# Altium schematic sheet FMC.SchDoc: FMC
size A4; Engineer: Samer Kilani; DocumentNumber: 5; SheetNumber: 5; SheetTotal: 9
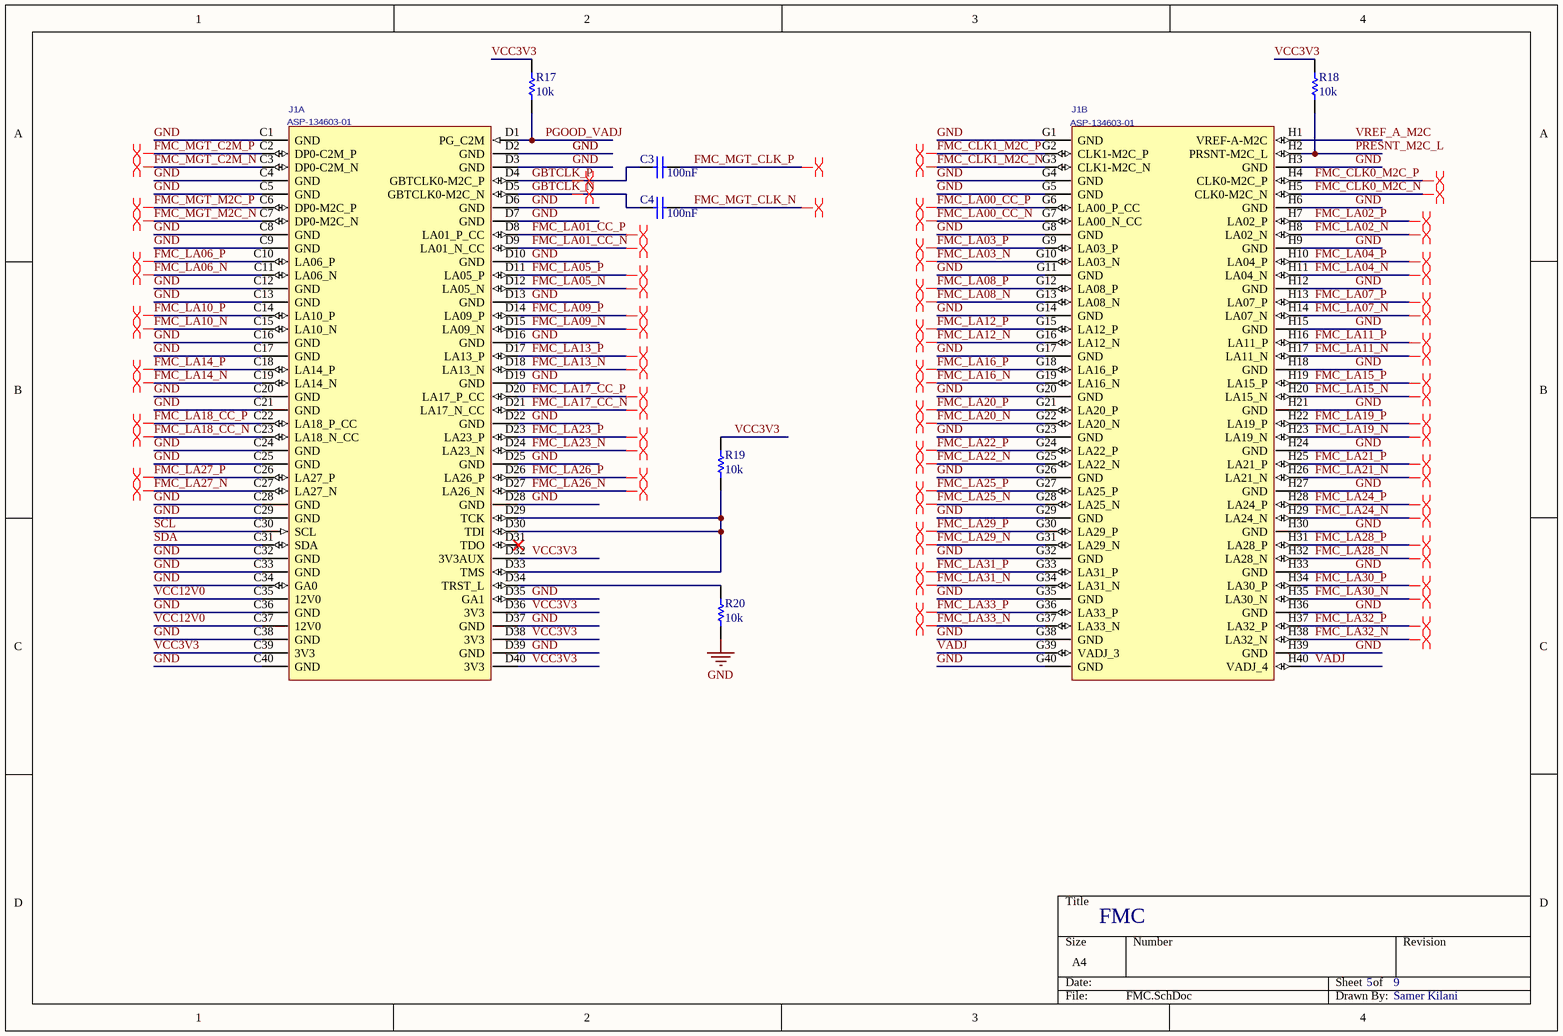
[diagram p0: FMC.SchDoc]

## Parts
C3  value 100nF  [C0402]  (hidden comment: Cap)
C4  value 100nF  [C0402]  (hidden comment: Cap)
J1  ASP-134603-01  [ASP-134603-01]  (parts A,B of 2)
R17  value 10k  [R0402]  (hidden comment: Res)
R18  value 10k  [R0402]  (hidden comment: Res)
R19  value 10k  [R0402]  (hidden comment: Res)
R20  value 10k  [R0402]  (hidden comment: Res)

## Nets
GND: J1.C1(GND) J1.C4(GND) J1.C5(GND) J1.C8(GND) J1.C9(GND) J1.C12(GND) J1.C13(GND) J1.C16(GND) J1.C17(GND) J1.C20(GND) J1.C21(GND) J1.C24(GND) J1.C25(GND) J1.C28(GND) J1.C29(GND) J1.C32(GND) J1.C33(GND) J1.C34(GA0) J1.C36(GND) J1.C38(GND) J1.C40(GND) J1.D2(GND) J1.D3(GND) J1.D6(GND) J1.D7(GND) J1.D10(GND) J1.D13(GND) J1.D16(GND) J1.D19(GND) J1.D22(GND) J1.D25(GND) J1.D28(GND) J1.D35(GA1) J1.D37(GND) J1.D39(GND) J1.G1(GND) J1.G4(GND) J1.G5(GND) J1.G8(GND) J1.G11(GND) J1.G14(GND) J1.G17(GND) J1.G20(GND) J1.G23(GND) J1.G26(GND) J1.G29(GND) J1.G32(GND) J1.G35(GND) J1.G38(GND) J1.G40(GND) J1.H3(GND) J1.H6(GND) J1.H9(GND) J1.H12(GND) J1.H15(GND) J1.H18(GND) J1.H21(GND) J1.H24(GND) J1.H27(GND) J1.H30(GND) J1.H33(GND) J1.H36(GND) J1.H39(GND) R20.1
FMC_CLK0_M2C_N: J1.H5(CLK0-M2C_N)
FMC_CLK0_M2C_P: J1.H4(CLK0-M2C_P)
FMC_CLK1_M2C_N: J1.G3(CLK1-M2C_N)
FMC_CLK1_M2C_P: J1.G2(CLK1-M2C_P)
FMC_LA00_CC_N: J1.G7(LA00_N_CC)
FMC_LA00_CC_P: J1.G6(LA00_P_CC)
FMC_LA01_CC_N: J1.D9(LA01_N_CC)
FMC_LA01_CC_P: J1.D8(LA01_P_CC)
FMC_LA02_N: J1.H8(LA02_N)
FMC_LA02_P: J1.H7(LA02_P)
FMC_LA03_N: J1.G10(LA03_N)
FMC_LA03_P: J1.G9(LA03_P)
FMC_LA04_N: J1.H11(LA04_N)
FMC_LA04_P: J1.H10(LA04_P)
FMC_LA05_N: J1.D12(LA05_N)
FMC_LA05_P: J1.D11(LA05_P)
FMC_LA06_N: J1.C11(LA06_N)
FMC_LA06_P: J1.C10(LA06_P)
FMC_LA07_N: J1.H14(LA07_N)
FMC_LA07_P: J1.H13(LA07_P)
FMC_LA08_N: J1.G13(LA08_N)
FMC_LA08_P: J1.G12(LA08_P)
FMC_LA09_N: J1.D15(LA09_N)
FMC_LA09_P: J1.D14(LA09_P)
FMC_LA10_N: J1.C15(LA10_N)
FMC_LA10_P: J1.C14(LA10_P)
FMC_LA11_N: J1.H17(LA11_N)
FMC_LA11_P: J1.H16(LA11_P)
FMC_LA12_N: J1.G16(LA12_N)
FMC_LA12_P: J1.G15(LA12_P)
FMC_LA13_N: J1.D18(LA13_N)
FMC_LA13_P: J1.D17(LA13_P)
FMC_LA14_N: J1.C19(LA14_N)
FMC_LA14_P: J1.C18(LA14_P)
FMC_LA15_N: J1.H20(LA15_N)
FMC_LA15_P: J1.H19(LA15_P)
FMC_LA16_N: J1.G19(LA16_N)
FMC_LA16_P: J1.G18(LA16_P)
FMC_LA17_CC_N: J1.D21(LA17_N_CC)
FMC_LA17_CC_P: J1.D20(LA17_P_CC)
FMC_LA18_CC_N: J1.C23(LA18_N_CC)
FMC_LA18_CC_P: J1.C22(LA18_P_CC)
FMC_LA19_N: J1.H23(LA19_N)
FMC_LA19_P: J1.H22(LA19_P)
FMC_LA20_N: J1.G22(LA20_N)
FMC_LA20_P: J1.G21(LA20_P)
FMC_LA21_N: J1.H26(LA21_N)
FMC_LA21_P: J1.H25(LA21_P)
FMC_LA22_N: J1.G25(LA22_N)
FMC_LA22_P: J1.G24(LA22_P)
FMC_LA23_N: J1.D24(LA23_N)
FMC_LA23_P: J1.D23(LA23_P)
FMC_LA24_N: J1.H29(LA24_N)
FMC_LA24_P: J1.H28(LA24_P)
FMC_LA25_N: J1.G28(LA25_N)
FMC_LA25_P: J1.G27(LA25_P)
FMC_LA26_N: J1.D27(LA26_N)
FMC_LA26_P: J1.D26(LA26_P)
FMC_LA27_N: J1.C27(LA27_N)
FMC_LA27_P: J1.C26(LA27_P)
FMC_LA28_N: J1.H32(LA28_N)
FMC_LA28_P: J1.H31(LA28_P)
FMC_LA29_N: J1.G31(LA29_N)
FMC_LA29_P: J1.G30(LA29_P)
FMC_LA30_N: J1.H35(LA30_N)
FMC_LA30_P: J1.H34(LA30_P)
FMC_LA31_N: J1.G34(LA31_N)
FMC_LA31_P: J1.G33(LA31_P)
FMC_LA32_N: J1.H38(LA32_N)
FMC_LA32_P: J1.H37(LA32_P)
FMC_LA33_N: J1.G37(LA33_N)
FMC_LA33_P: J1.G36(LA33_P)
FMC_MGT_C2M_N: J1.C3(DP0-C2M_N)
FMC_MGT_C2M_P: J1.C2(DP0-C2M_P)
FMC_MGT_CLK_N: C4.2
FMC_MGT_CLK_P: C3.2
FMC_MGT_M2C_N: J1.C7(DP0-M2C_N)
FMC_MGT_M2C_P: J1.C6(DP0-M2C_P)
GBTCLK_N: C4.1 J1.D5(GBTCLK0-M2C_N)
GBTCLK_P: C3.1 J1.D4(GBTCLK0-M2C_P)
PGOOD_VADJ: J1.D1(PG_C2M) R17.1
PRESNT_M2C_L: J1.H2(PRSNT-M2C_L) R18.1
SCL: J1.C30(SCL)
SDA: J1.C31(SDA)
VADJ: J1.G39(VADJ_3) J1.H40(VADJ_4)
VCC3V3: J1.C39(3V3) J1.D32(3V3AUX) J1.D36(3V3) J1.D38(3V3) J1.D40(3V3) R17.2 R18.2 R19.2
VCC12V0: J1.C35(12V0) J1.C37(12V0)
VREF_A_M2C: J1.H1(VREF-A-M2C)
NetJ1_D29: J1.D29(TCK) J1.D30(TDI) J1.D33(TMS) R19.1
NetJ1_D34: J1.D34(TRST_L) R20.2

Not connected (* = marked no-connect by the designer): J1 D31(TDO)*

## Layout directives
differential pair: FMC_CLK0_M2C_N, FMC_CLK0_M2C_P, FMC_CLK1_M2C_N, FMC_CLK1_M2C_P, FMC_LA00_CC_N, FMC_LA00_CC_P, FMC_LA01_CC_N, FMC_LA01_CC_P, FMC_LA02_N, FMC_LA02_P, FMC_LA03_N, FMC_LA03_P, FMC_LA04_N, FMC_LA04_P, FMC_LA05_N, FMC_LA05_P, FMC_LA06_N, FMC_LA06_P, FMC_LA07_N, FMC_LA07_P, FMC_LA08_N, FMC_LA08_P, FMC_LA09_N, FMC_LA09_P, FMC_LA10_N, FMC_LA10_P, FMC_LA11_N, FMC_LA11_P, FMC_LA12_N, FMC_LA12_P, FMC_LA13_N, FMC_LA13_P, FMC_LA14_N, FMC_LA14_P, FMC_LA15_N, FMC_LA15_P, FMC_LA16_N, FMC_LA16_P, FMC_LA17_CC_N, FMC_LA17_CC_P, FMC_LA18_CC_N, FMC_LA18_CC_P, FMC_LA19_N, FMC_LA19_P, FMC_LA20_N, FMC_LA20_P, FMC_LA21_N, FMC_LA21_P, FMC_LA22_N, FMC_LA22_P, FMC_LA23_N, FMC_LA23_P, FMC_LA24_N, FMC_LA24_P, FMC_LA25_N, FMC_LA25_P, FMC_LA26_N, FMC_LA26_P, FMC_LA27_N, FMC_LA27_P, FMC_LA28_N, FMC_LA28_P, FMC_LA29_N, FMC_LA29_P, FMC_LA30_N, FMC_LA30_P, FMC_LA31_N, FMC_LA31_P, FMC_LA32_N, FMC_LA32_P, FMC_LA33_N, FMC_LA33_P, FMC_MGT_C2M_N, FMC_MGT_C2M_P, FMC_MGT_CLK_N, FMC_MGT_CLK_P, FMC_MGT_M2C_N, FMC_MGT_M2C_P, GBTCLK_N, GBTCLK_P

## Library data of the parts
C3 C4 = Cap: Capacitor; Published: 8-Jun-2000; LatestRevisionDate: 17-Jul-2002; LatestRevisionNote: Re-released for DXP Platform.; PackageReference: RAD-0.3; Publisher: Altium Limited; PackageDescription: Radial Cap, Thru-Hole; 2 Leads; 0.3 in Pin Spacing
J1 = ASP-134603-01: 0.050" PITCH SOCKET ARRAY ASSEMBLY.; MANUFACTURER: SAMTEC; CREATED: February 27, 2014 - Wedny Xin; PCB DECAL: ASP-134603-01
R17-R20 = Res: Resistor